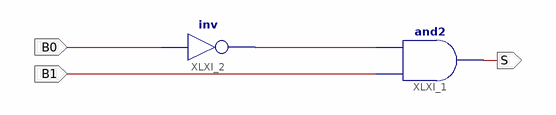
[diagram p0: schematic sheet 1]
// Xilinx ISE schematic AddSubSelect.sch (spartan3e) as structural Verilog: 2 symbols, 3 ports
module AddSubSelect (
  input  B0,
  input  B1,
  output S
);

  wire XLXN_1;

  and XLXI_1 (S, B1, XLXN_1);
  not XLXI_2 (XLXN_1, B0);
endmodule
